# EAGLE design GryoBoard (EAGLE 5.03)
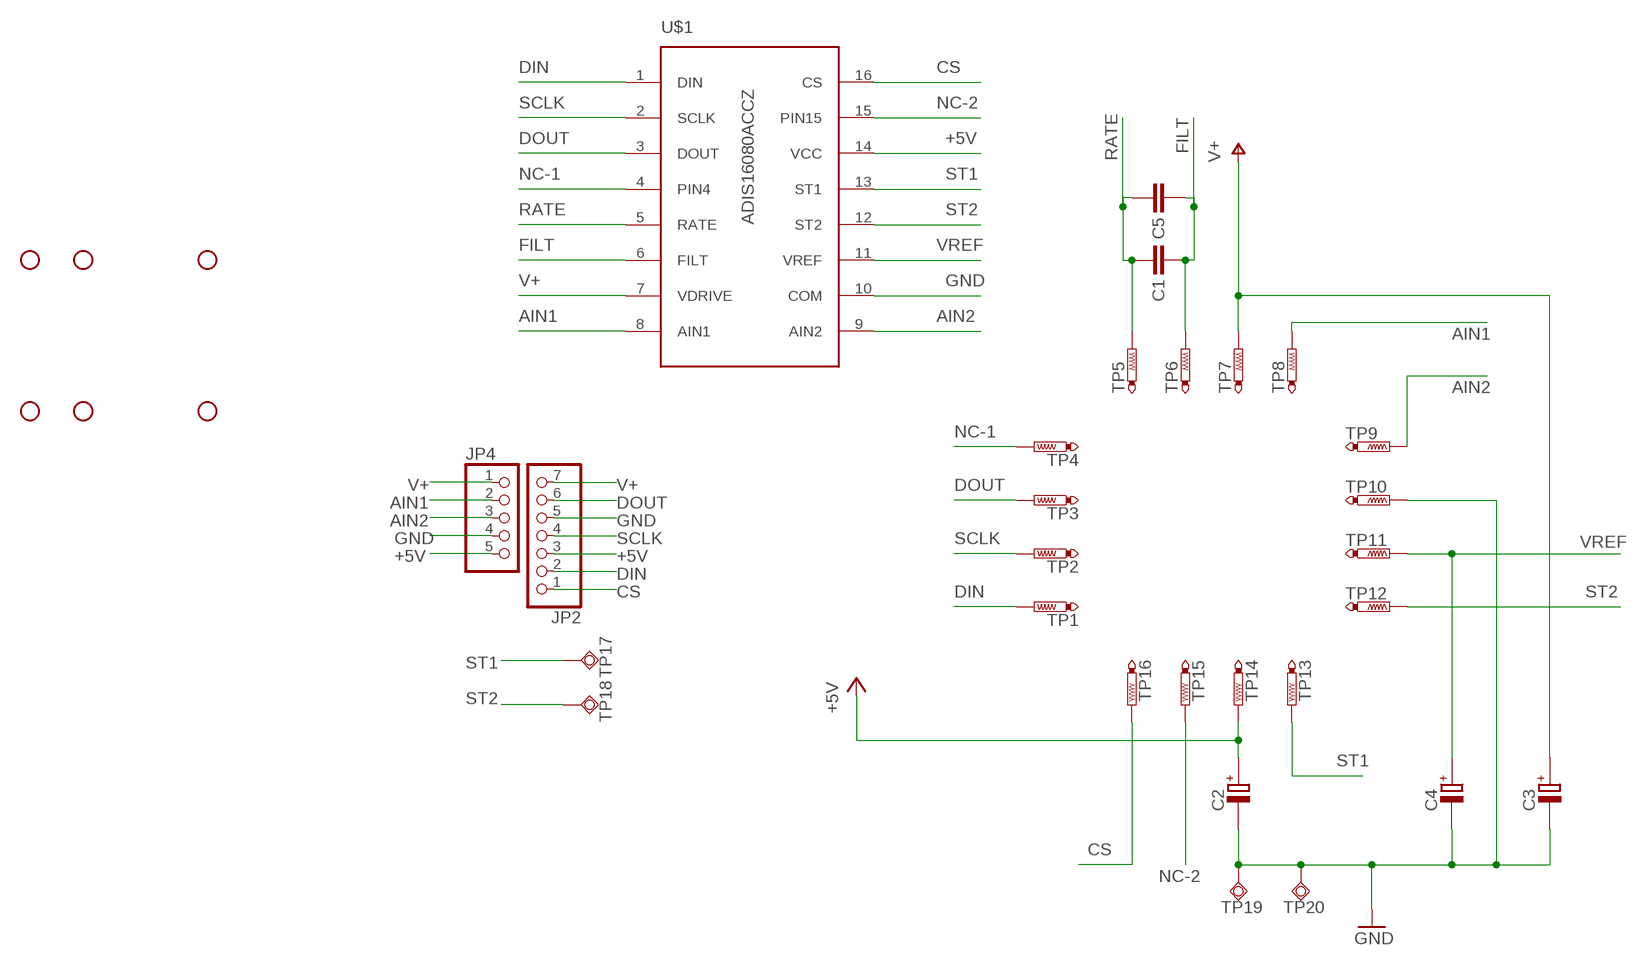
[diagram p0: schematic, sheet 1]

## Parts
C1  C-EUC3216  [C3216]
C2  POLARISED_A_CASE  [CAPMP3216X180N]
C3  POLARISED_A_CASE  [CAPMP3216X180N]
C4  POLARISED_A_CASE  [CAPMP3216X180N]
C5  C-EUC3216  [C3216]
JP2  PINHD-1X7  [1X07]
JP4  PINHD-1X5  [1X05]
TP1  PTR1TP20SQ  [TP20SQ]
TP2  PTR1TP20SQ  [TP20SQ]
TP3  PTR1TP20SQ  [TP20SQ]
TP4  PTR1TP20SQ  [TP20SQ]
TP5  PTR1TP20SQ  [TP20SQ]
TP6  PTR1TP20SQ  [TP20SQ]
TP7  PTR1TP20SQ  [TP20SQ]
TP8  PTR1TP20SQ  [TP20SQ]
TP9  PTR1TP20SQ  [TP20SQ]
TP10  PTR1TP20SQ  [TP20SQ]
TP11  PTR1TP20SQ  [TP20SQ]
TP12  PTR1TP20SQ  [TP20SQ]
TP13  PTR1TP20SQ  [TP20SQ]
TP14  PTR1TP20SQ  [TP20SQ]
TP15  PTR1TP20SQ  [TP20SQ]
TP16  PTR1TP20SQ  [TP20SQ]
TP17  TPSQTP10SQ  [TP10SQ]
TP18  TPSQTP10SQ  [TP10SQ]
TP19  TPSQTP10SQ  [TP10SQ]
TP20  TPSQTP10SQ  [TP10SQ]
U$1  ADIS16080ACCZ  [16PLGA]
U$2  STAND-OFF  [STAND-OFF]
U$3  STAND-OFF  [STAND-OFF]
U$4  STAND-OFF  [STAND-OFF]
U$5  STAND-OFF  [STAND-OFF]
U$6  STAND-OFF  [STAND-OFF]
U$7  STAND-OFF  [STAND-OFF]

## Nets
+5V: C2.+ JP2.3 JP4.5 TP14.TP U$1.14(VCC)
AIN1: JP4.2 TP8.TP U$1.8(AIN1)
AIN2: JP4.3 TP9.TP U$1.9(AIN2)
CS: JP2.1 TP16.TP U$1.16(CS)
DIN: JP2.2 TP1.TP U$1.1(DIN)
DOUT: JP2.6 TP3.TP U$1.3(DOUT)
FILT: C1.1 C5.1 TP6.TP U$1.6(FILT)
GND: C2.- C3.- C4.- JP2.5 JP4.4 TP10.TP TP19.TP TP20.TP U$1.10(COM)
NC-1: TP4.TP U$1.4(PIN4)
NC-2: TP15.TP U$1.15(PIN15)
RATE: C1.2 C5.2 TP5.TP U$1.5(RATE)
SCLK: JP2.4 TP2.TP U$1.2(SCLK)
ST1: TP13.TP TP17.TP U$1.13(ST1)
ST2: TP12.TP TP18.TP U$1.12(ST2)
V+: C3.+ JP2.7 JP4.1 TP7.TP U$1.7(VDRIVE)
VREF: C4.+ TP11.TP U$1.11(VREF)

## Library data of the parts
C1 C5 = rcl:C-EU: CAPACITOR, European symbol
C2-C4 = ipc-7351-capacitor:POLARISED_
JP2 = pinhead:PINHD-1X7: PIN HEADER
JP4 = pinhead:PINHD-1X5: PIN HEADER
TP1-TP16 = testpad:PTR1: TEST PIN
TP17-TP20 = testpad:TPSQ: Test pad
U$1 = ADISGyros:ADIS16080
U$2-U$7 = SparkFun:STAND-OFF: Stand Off This is the mechanical footprint for a #4 phillips button head screw. Use the keepout ring to avoid running the screw head into surrounding components. SKU : PRT-00447

## Board
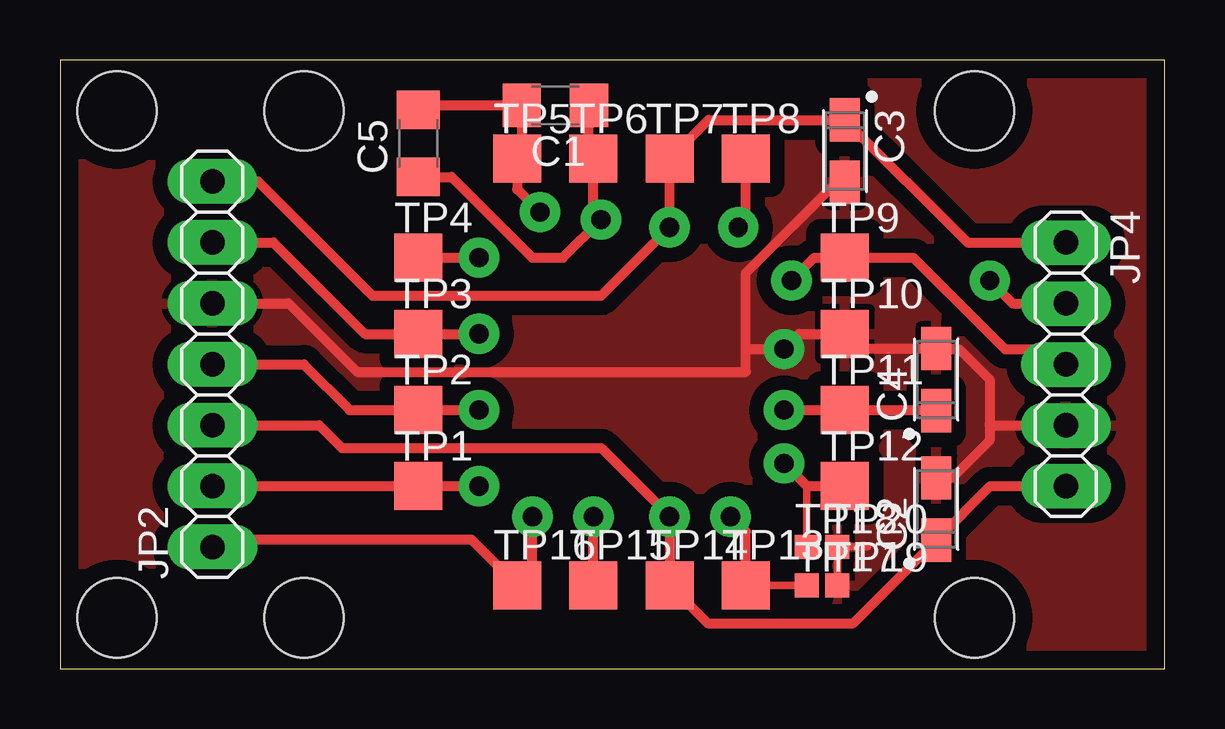
[diagram p1: board, top side]
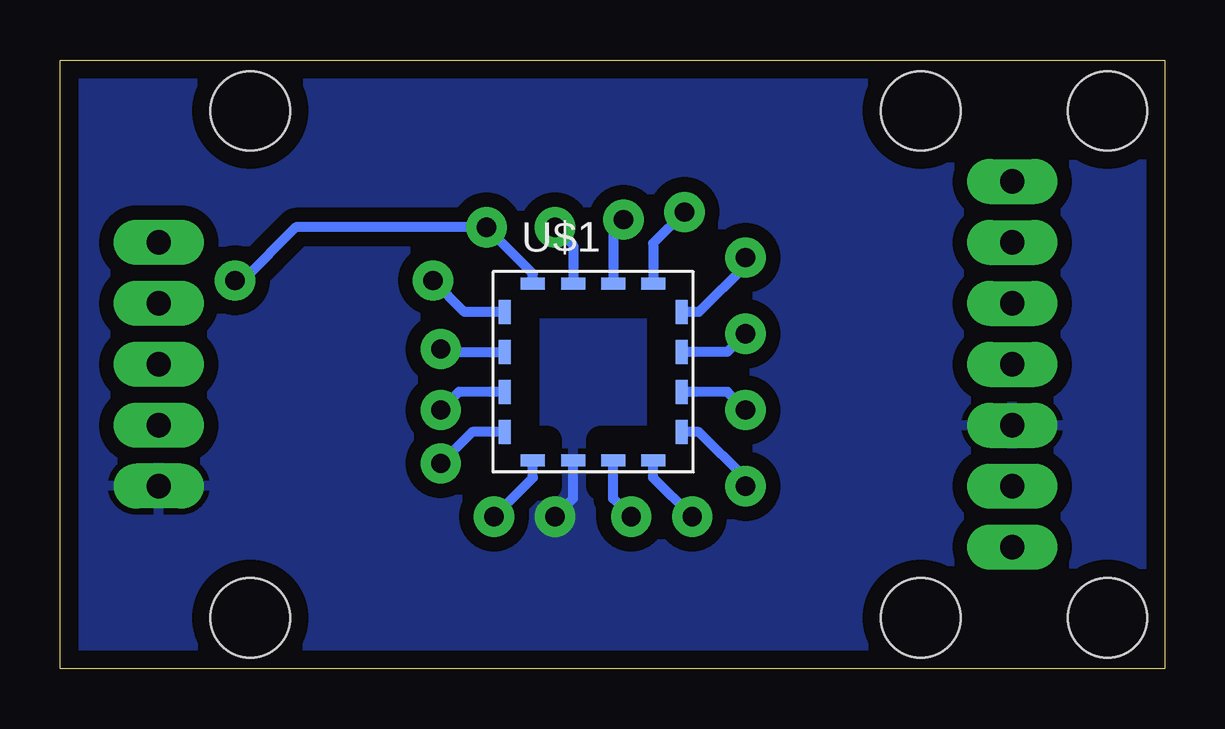
[diagram p2: board, bottom side, seen from below]

Size 46.02 x 25.39 mm. Coordinates in mm from the lower left corner, seen from the top.
Outline: 0,0 46.02,0 46.02,25.39 0,25.39 0,0
Copper layers (1*16): Top 0.035mm / dielectric 1.5mm / Bottom 0.035mm
Design rules "default *": minimum track width 15mil, minimum drill 0.8mm, track to track 12mil, track to pad 12mil, pad to pad 12mil, via to via 12mil, smd to smd 12mil, copper to edge 30mil, drill to drill 12mil, minimum pad ring 17mil, minimum via ring 17mil, stop-mask expansion 4mil, vias tented up to drill 0mil, thermal gap 10mil
bRestrict: area 26.7,7.6 to 28.6,17.1; area 19,7.6 to 21,17.1; area 21,7.6 to 23.5,9.5; area 25.7,7.6 to 26.7,9.5; area 21,15.2 to 26.7,17.1

### Footprints (pad centres in the part's own frame; a part is rotated, then mirrored left to right if it is on the bottom)
C3216 = smd 1.6 x 1.8: 1 -1.4,0; 2 1.4,0
CAPMP3216X180N = smd 1.8 x 1.25: + -1.3,0; - 1.3,0
1X07 = drill 1.016 long: 1 -7.62,0; 2 -5.08,0; 3 -2.54,0; 4 0,0; 5 2.54,0; 6 5.08,0; 7 7.62,0
1X05 = drill 1.016 long: 1 -5.08,0; 2 -2.54,0; 3 0,0; 4 2.54,0; 5 5.08,0
TP20SQ = smd 2 x 2: TP 0,0
TP10SQ = smd 1 x 1: TP 0,0
16PLGA = smd 0.5 x 1: 1 3.687,-2.505; 2 3.687,-0.835; 3 3.687,0.835; 4 3.687,2.505; 9 -3.687,2.505; 10 -3.687,0.835; 11 -3.687,-0.835; 12 -3.687,-2.505 | smd 1 x 0.5: 5 2.505,3.687; 6 0.835,3.687; 7 -0.835,3.687; 8 -2.505,3.687; 13 -2.505,-3.687; 14 -0.835,-3.687; 15 0.835,-3.687; 16 2.505,-3.687
STAND-OFF = hole 3.302: 0,0

### Placement (x,y rotation side)
C1  20.64,23.5 180 top
C2  36.51,6.67 90 top
C3  32.7,21.59 270 top
C4  36.51,12.06 90 top
C5  14.92,21.91 90 top
JP2  6.35,12.7 90 top
JP4  41.91,12.7 270 top
TP1  14.92,7.62 0 top
TP2  14.92,10.79 0 top
TP3  14.92,13.97 0 top
TP4  14.92,17.14 0 top
TP5  19.05,21.27 0 top
TP6  22.23,21.27 0 top
TP7  25.4,21.27 0 top
TP8  28.57,21.27 0 top
TP9  32.7,17.14 0 top
TP10  32.7,13.97 0 top
TP11  32.7,10.79 0 top
TP12  32.7,7.62 0 top
TP13  28.57,3.49 0 top
TP14  25.4,3.49 0 top
TP15  22.23,3.49 0 top
TP16  19.05,3.49 0 top
TP17  31.11,3.49 0 top
TP18  31.11,5.08 0 top
TP19  32.38,3.49 0 top
TP20  32.38,5.08 0 top
U$1  23.81,12.38 0 bottom
U$2  2.38,2.13 0 top
U$3  2.38,23.27 0 top
U$4  38.1,23.27 0 top
U$5  38.1,2.13 0 top
U$6  10.16,23.27 0 top
U$7  10.16,2.13 0 top

### Tracks (layer width: path | path; a pad name or v marks a point on that pad's centre or on a via)
+5V  (via drill 0.8 pad 1.68)
  Top 0.406: JP2.3 10.79,10.16 11.75,9.21 22.54,9.21 v25.4,6.35 TP14.TP 26.99,1.91 33.05,1.91 C2.+ 38.77,7.62 JP4.5
  Bottom 0.406: U$1.14 24.65,7.1 v25.4,6.35
  pour Bottom (isolate 0.61): 0,25.4 0,0 46.04,0 46.04,25.4
AIN1  (via drill 0.8 pad 1.68)
  Top 0.406: v28.26,18.41 28.57,18.73 TP8.TP | v38.73,16.19 39.69,15.24 JP4.2
  Bottom 0.406: U$1.8 26.32,16.48 v28.26,18.41 36.2,18.41 38.42,16.19 v38.73,16.19
AIN2  (via drill 0.8 pad 1.68)
  Top 0.406: v30.48,16.19 31.43,17.14 TP9.TP 35.56,17.14 39.37,13.34 41.27,13.34 JP4.3
  Bottom 0.406: U$1.9 29.18,14.89 v30.48,16.19
CS  (via drill 0.8 pad 1.68)
  Top 0.406: v19.68,6.35 19.68,4.13 TP16.TP 17.14,5.4 6.67,5.4 JP2.1
  Bottom 0.406: U$1.16 21.31,7.97 v19.68,6.35
DIN  (via drill 0.8 pad 1.68)
  Top 0.406: v17.46,7.62 TP1.TP JP2.2
  Bottom 0.406: U$1.1 19.4,9.88 17.46,7.94 v17.46,7.62
DOUT  (via drill 0.8 pad 1.68)
  Top 0.406: TP3.TP 12.7,13.97 8.89,17.78 JP2.6 | TP3.TP 15.24,13.65 | TP3.TP v17.46,13.97
  Bottom 0.406: U$1.3 18.21,13.22 v17.46,13.97
FILT  (via drill 0.8 pad 1.68)
  Top 0.406: C1.1 22.04,21.46 TP6.TP 22.23,19.05 v22.54,18.73 20.95,17.14 19.68,17.14 16.32,20.51 C5.1 15.05,20.32
  Bottom 0.406: U$1.6 22.98,18.3 v22.54,18.73
GND  (via drill 0.8 pad 1.68)
  Top 0.305: 33.66,5.08 TP20.TP TP19.TP
  Top 0.406: 28.57,13.34 28.57,12.38 12.38,12.38 9.53,15.24 JP2.5 | 28.57,13.34 v30.16,13.34 30.8,13.97 TP10.TP 33.31,13.37 C4.- 36.54,13.34 37.47,13.34 38.73,12.06 38.73,10.16 | 28.57,13.34 28.57,16.51 32.35,20.29 C3.- | 38.73,10.16 38.73,9.53 37.18,7.97 C2.- 36.51,7.94 | 38.73,10.16 JP4.4
  Bottom 0.406: U$1.10 30.05,13.22 arc90 v30.16,13.34
  pour Top (isolate 0.61): 0,0 46.04,0 46.04,25.4 0,25.4
NC-1  (via drill 0.8 pad 1.68)
  Top 0.406: 15.24,16.83 TP4.TP v17.46,17.14
  Bottom 0.406: U$1.4 19.4,14.89 17.46,16.83 v17.46,17.14
NC-2  (via drill 0.8 pad 1.68)
  Top 0.406: TP15.TP v22.23,6.35
  Bottom 0.406: U$1.15 22.98,7.1 v22.23,6.35
RATE  (via drill 0.8 pad 1.68)
  Top 0.406: v20,19.05 19.05,20 TP5.TP 19.24,21.46 C1.2 15.11,23.5 C5.2
  Bottom 0.406: U$1.5 21.31,17.75 v20,19.05
SCLK  (via drill 0.8 pad 1.68)
  Top 0.406: v17.46,10.79 TP2.TP 12.06,10.79 10.16,12.7 JP2.4
  Bottom 0.406: U$1.2 18.21,11.55 v17.46,10.79
ST1  (via drill 0.8 pad 1.68)
  Top 0.305: TP13.TP TP17.TP
  Top 0.406: TP13.TP 28.57,5.71 v27.94,6.35
  Bottom 0.406: v27.94,6.35 26.32,7.97 U$1.13
ST2  (via drill 0.8 pad 1.68)
  Top 0.305: 31.11,7.62 TP18.TP
  Top 0.406: TP12.TP 31.11,7.62 v30.16,8.57
  Bottom 0.406: U$1.12 28.86,9.88 v30.16,8.57
V+  (via drill 0.8 pad 1.68)
  Top 0.406: JP2.7 8.26,20.32 13.02,15.56 22.54,15.56 v25.4,18.41 TP7.TP 27.02,22.89 C3.+ 37.81,17.78 JP4.1
  Bottom 0.406: U$1.7 24.65,17.66 v25.4,18.41
VREF  (via drill 0.8 pad 1.68)
  Top 0.406: v30.16,10.79 TP11.TP 36.48,10.79 C4.+
  Bottom 0.406: U$1.11 29.41,11.55 v30.16,10.79